# EasyEDA Pro project ProPrj_收音机.epro

# Schematic Schematic1

## Sheets
1 P1: Board Name: Board1; Create Date: 2025-11-10; Page Name: P1; Project Name: 收音机; Schematic Name: Schematic1; Update Date: 2025-11-12; Company: 嘉立创EDA; Page Size: A4; Version: V1.0
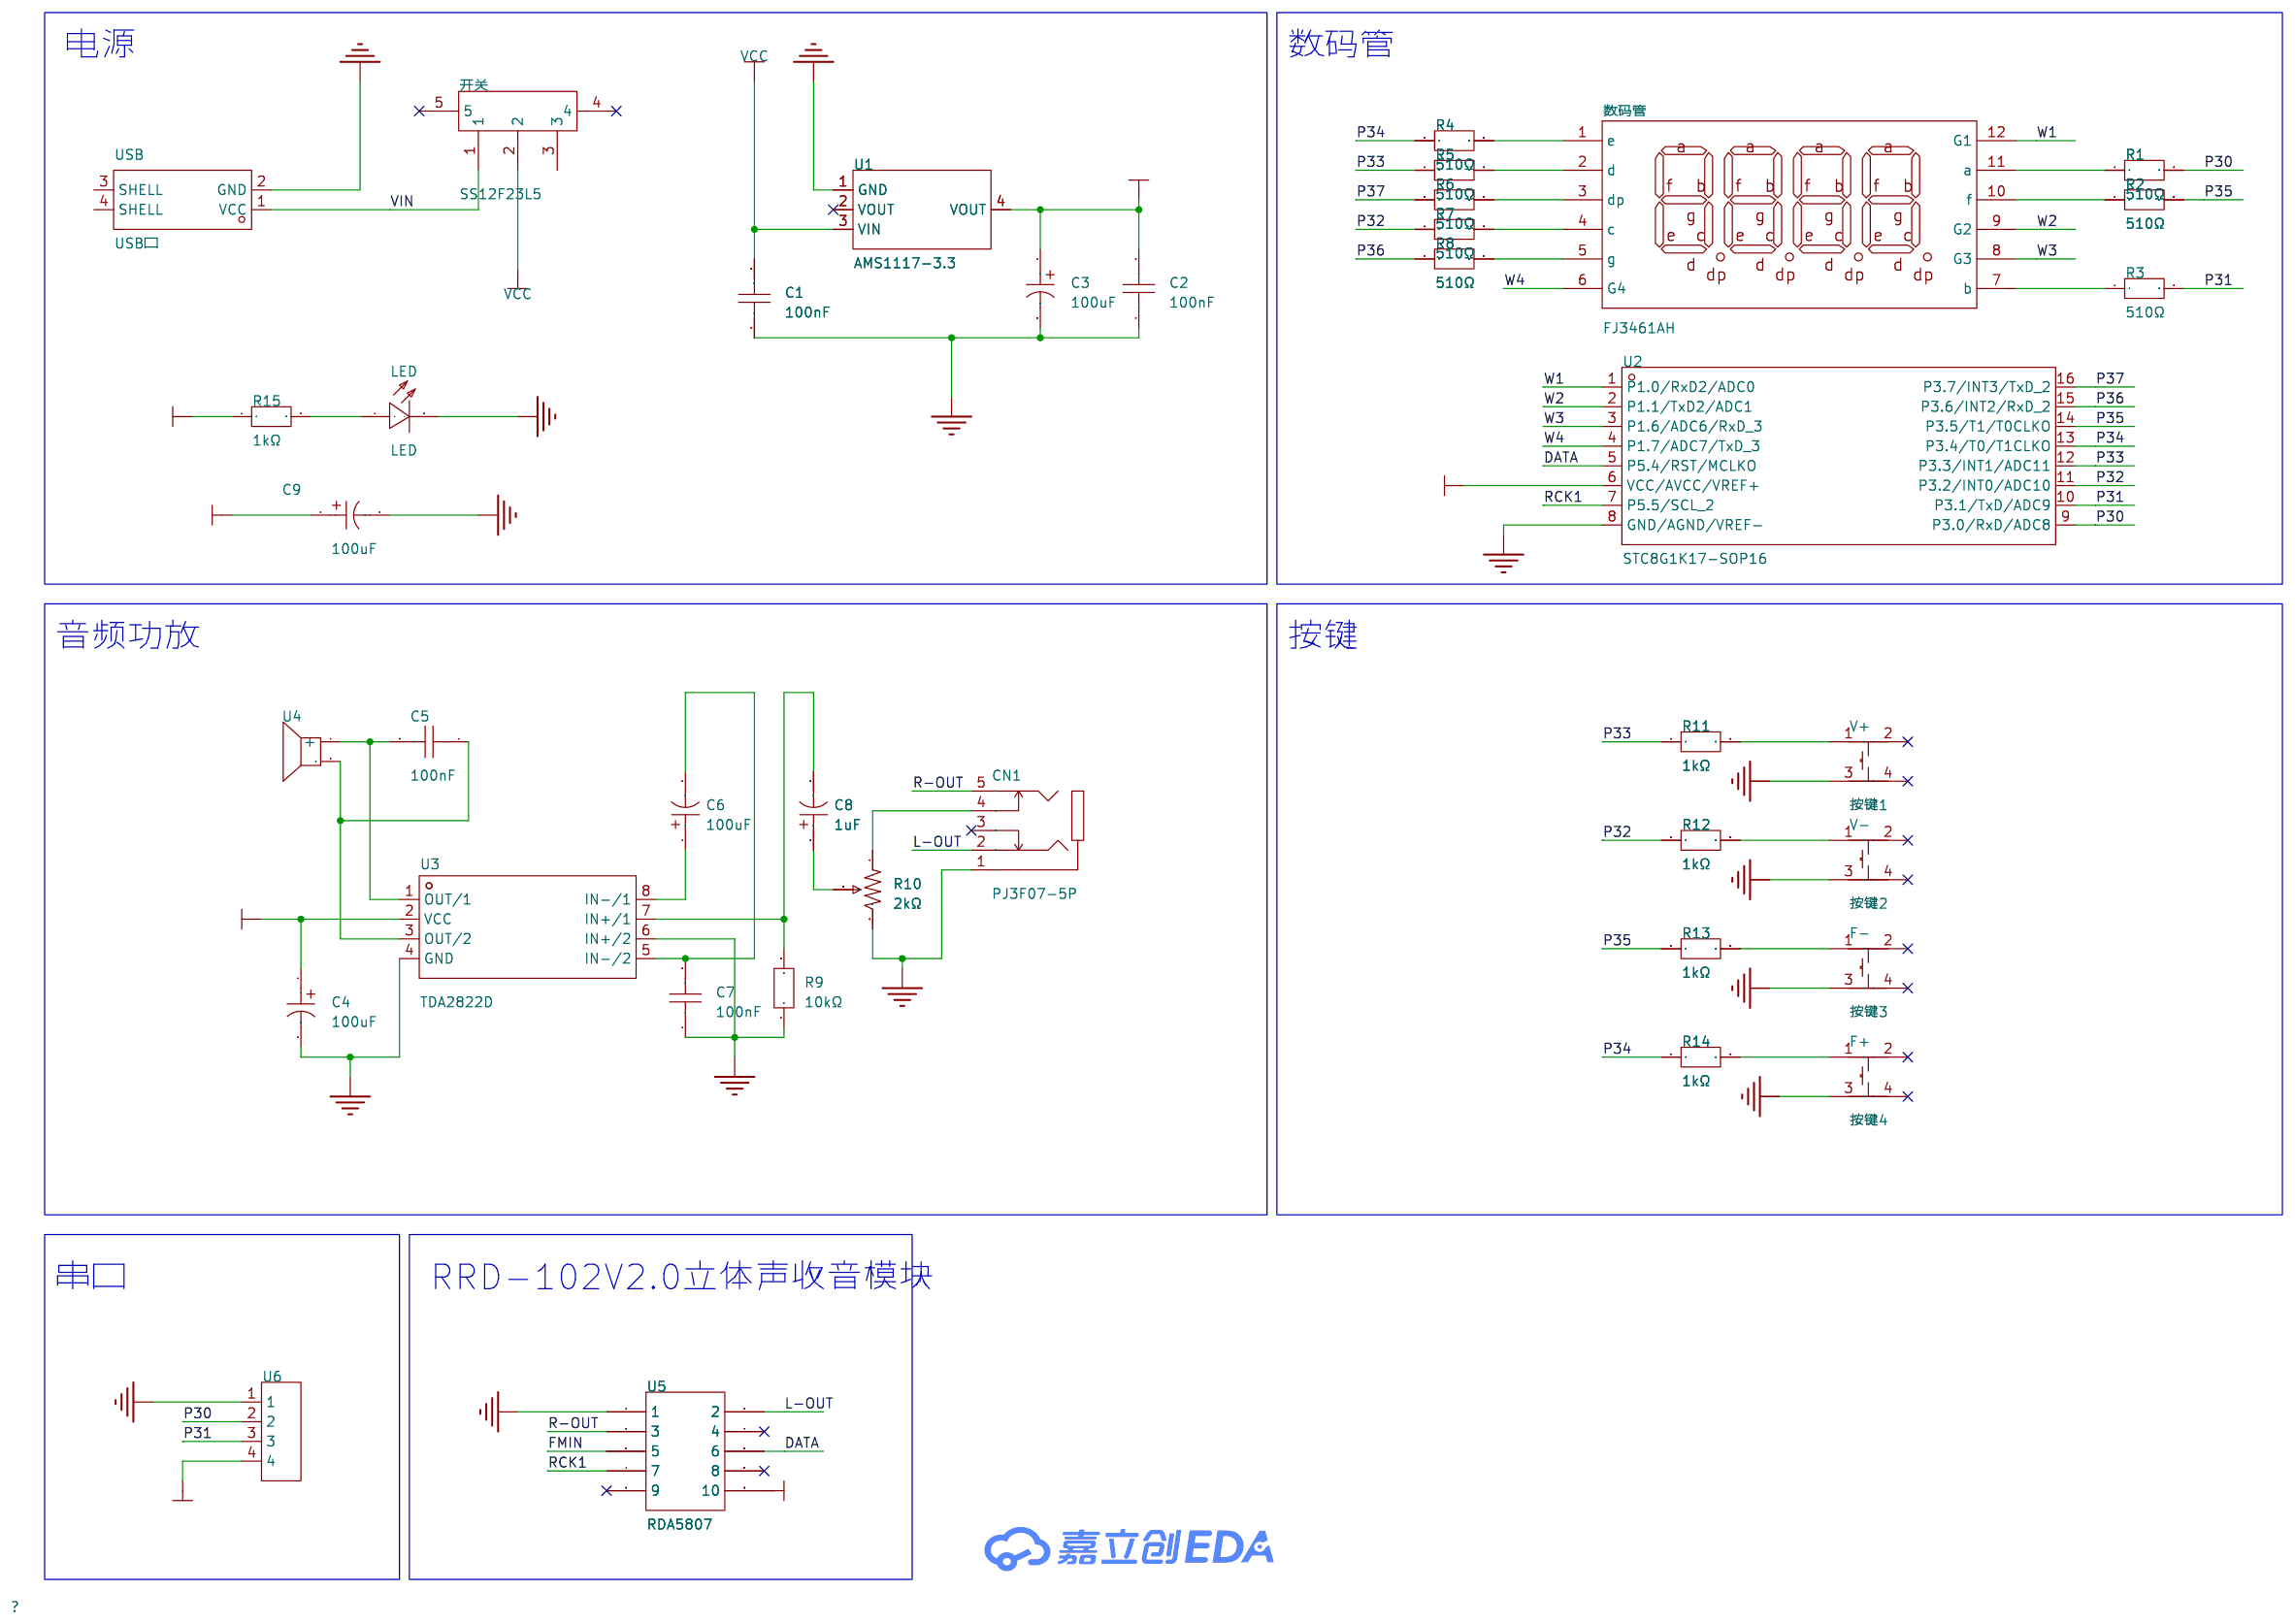
[diagram p0: P1]
2 P2: Create Date: 2025-11-11
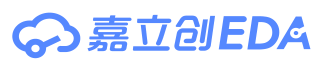
[diagram p1: P2]

## Parts
C1  100nF  [C0603]
C2  100nF  [C0603]
C3  100uF  [CAP-TH_BD8.0-P3.50-D0.6-FD_1]
C4  100uF  [CAP-TH_BD8.0-P3.50-D0.6-FD_1]
C5  100nF  [C0603]
C6  100uF  [CAP-TH_BD8.0-P3.50-D0.6-FD_1]
C7  100nF  [C0603]
C8  1uF  [CAP-SMD_BD4.0-L4.3-W4.3-LS5.0-FD]
C9  100uF  [CAP-TH_BD8.0-P3.50-D0.6-FD_1]
CN1  PJ3F07-5P  [AUDIO-TH_PJ3F07-5P]
F+  按键4  [KEY-SMD_4P-L6.0-W6.0-P4.50-LS8.6]
F-  按键3  [KEY-SMD_4P-L6.0-W6.0-P4.50-LS8.6]
LED  LED  [LED-TH_BD4.0-P2.54-FD_RED]
R1  510Ω  [R0805]
R2  510Ω  [R0805]
R3  510Ω  [R0805]
R4  510Ω  [R0805]
R5  510Ω  [R0805]
R6  510Ω  [R0805]
R7  510Ω  [R0805]
R8  510Ω  [R0805]
R9  10kΩ  [R0805]
R10  2kΩ  [RES-ADJ-TH_3362X]
R11  1kΩ  [R0603]
R12  1kΩ  [R0603]
R13  1kΩ  [R0603]
R14  1kΩ  [R0603]
R15  1kΩ  [R0805]
U1  AMS1117-3.3  [SOT-223-3_L6.5-W3.4-P2.30-LS7.0-BR]
U2  STC8G1K17-SOP16  [SOP-16_L9.9-W3.9-P1.27-LS6.0-BL]
U3  TDA2822D  [SOIC-8_L4.9-W3.9-P1.27-LS6.0-BL]
U4  2.048kHz  [BUZ-TH_BD16.0-P7.60-D0.7]
U5  Header-D-F 2x5P  [RDA5807]
U6  HX PZ2.54-1x4P ZZ  [HDR-TH_4P-P2.54-V-M]
USB  USB口  [MICRO-USB-TH_KH-MICRO-DIP-2P]
V+  按键1  [KEY-SMD_4P-L6.0-W6.0-P4.50-LS8.6]
V-  按键2  [KEY-SMD_4P-L6.0-W6.0-P4.50-LS8.6]
开关  SS12F23L5  [SW-TH_XKBCONNECTIVITY_SS12F23L5]
数码管  FJ3461AH  [LED-SEG-TH_12P-L30.0-W14.0-P2.54-S10.16-BL]

## Library data of the parts
C1 C2 C5 C7 = CC0603KRX7R9BB104: 容值:100nF;精度:±10%;额定电压:50V;温度系数:X7R;; LCSC Part Name: 100nF ±10% 50V; Supplier Part: C14663; Manufacturer: YAGEO(国巨); Supplier Footprint: 0603; JLCPCB Part Class: 基础库; Datasheet: https://item.szlcsc.com/datasheet/CC0603KRX7R9BB104/15331.html; Supplier: LCSC; Tolerance: ±10%; Voltage Rating: 50V; Temperature Coefficient: X7R
C3 C4 C6 C9 = 100uF: Supplier Part: C9900016884; Supplier Footprint: CAP-TH_BD8.0-P3.50-D1.0-FD; JLCPCB Part Class: 扩展库; Supplier: LCSC
C8 = RST50V1M4X5: 容值:1uF;精度:±20%;额定电压:50V;纹波电流:7mA@120Hz;; LCSC Part Name: 1uF ±20% 50V; Supplier Part: C48970983; Manufacturer: JIERR(捷而瑞); Supplier Footprint: SMD,D4xL5.4mm; JLCPCB Part Class: Extended Part; Datasheet: https://item.szlcsc.com/datasheet/RST50V1M4X5/51296188.html; Supplier: LCSC; Tolerance: ±20%; Voltage Rating: 50V; Ripple Current: 7mA@120Hz; Diameter: 4mm; Height - Seated (Max): 5.4mm; Lifetime: 2000hrs@105℃; Operating Temperature: -40℃~+105℃
CN1 = PJ3F07-5P: 连接器类型:3.5mm耳机座;额定电流:500mA;额定电压:30V;触头材质:铜;触头镀层:银;工作温度:-30℃~+70℃;; LCSC Part Name: 3.5mm耳机座 停产; Supplier Part: C668604; Manufacturer: SHOU HAN(首韩); Supplier Footprint: 插件; JLCPCB Part Class: 扩展库; Datasheet: https://item.szlcsc.com/datasheet/PJ3F07-5P/698547.html; Supplier: LCSC; Connector Type: 3.5mm耳机座; Current Rating: 500mA; Voltage Rating (Max): 30V; Contact Material: 铜; Contact Plating: 银; Operating Temperature: -30℃~+70℃
F+ F- V+ V- = ZX-QC66-7.5TP: 电路结构:单刀单掷;按钮形状:圆形按钮;作用力:2.6N;安装方式:立贴;开关长度:6mm;开关宽度:6mm;开关高度:7.5mm;带支架:不带支架;触点电流:50mA;额定电压:12V;工作寿命:10万次;; LCSC Part Name: 6*6*7.5贴片; Supplier Part: C7470157; Manufacturer: Megastar(兆星); Supplier Footprint: SMD-4P,6x6mm; JLCPCB Part Class: 扩展库; Datasheet: https://item.szlcsc.com/datasheet/ZX-QC66-7.5TP/8519163.html; Supplier: LCSC; Circuit: 单刀单掷; Actuator Style: 圆形按钮; Operating Force: 2.6N; Mounting Type: 立贴; Length: 6mm; Width: 6mm; Switch Height: 7.5mm; with Bracket: 不带支架; Contact Current: 50mA; Voltage Rating: 12V; Actuator/Cap Color: 黑色; Termination Style: 鸥翼型; Life: 10万次; Operating Temperature: -30℃~+80℃
LED = LED: Supplier Part: C9900015665; Supplier Footprint: SIP-2P; JLCPCB Part Class: 扩展库; Supplier: LCSC
R1-R8 = 0805W8F5100T5E: 电阻类型:厚膜电阻;阻值:510Ω;精度:±1%;功率:125mW;工作电压:150V;温度系数:±100ppm/℃;; LCSC Part Name: 510Ω ±1% 125mW 厚膜电阻; Supplier Part: C17734; Manufacturer: UNI-ROYAL(厚声); Supplier Footprint: 0805; JLCPCB Part Class: Basic Part; Datasheet: https://item.szlcsc.com/datasheet/0805W8F5100T5E/18422.html; Supplier: LCSC; Type: 厚膜电阻; Tolerance: ±1%; Power(Watts): 125mW; Voltage-Supply(Max): 150V; Temperature Coefficient: ±100ppm/℃; Operating Temperature: -55℃~+155℃
R9 = 0805W8F1002T5E_C17414: 电阻类型:厚膜电阻;阻值:10kΩ;精度:±1%;功率:125mW;工作电压:150V;温度系数:±100ppm/℃;; LCSC Part Name: 10kΩ ±1% 125mW 厚膜电阻; Supplier Part: C17414; Manufacturer: UNI-ROYAL(厚声); Manufacturer Part: 0805W8F1002T5E; Supplier Footprint: 0805; JLCPCB Part Class: Basic Part; Datasheet: https://item.szlcsc.com/datasheet/0805W8F1002T5E/18102.html; Supplier: LCSC; Type: 厚膜电阻; Tolerance: ±1%; Power(Watts): 125mW; Voltage-Supply(Max): 150V; Temperature Coefficient: ±100ppm/℃; Operating Temperature: -55℃~+155℃
R10 = 3362X-1-202: 阻值:2kΩ;精度:±10%;功率:500mW;温度系数:±250ppm/℃;; Supplier Part: C48997899; Manufacturer: JIERR(捷而瑞); Supplier Footprint: 插件-3P,7x6.8mm; JLCPCB Part Class: 扩展库; Datasheet: https://item.szlcsc.com/datasheet/3362X-1-202/51342035.html; Supplier: LCSC; Tolerance: ±10%; Power(Watts): 500mW; Temperature Coefficient: ±250ppm/℃; Number of Turns: 1
R11-R14 = SR0603JR-071KL: 电阻类型:厚膜电阻;阻值:1kΩ;精度:±5%;功率:100mW;工作电压:150V;温度系数:±100ppm/℃;; LCSC Part Name: 厚膜电阻 1kΩ ±5% 100mW; Supplier Part: C873708; Manufacturer: YAGEO(国巨); Supplier Footprint: 0603; JLCPCB Part Class: 扩展库; Datasheet: https://item.szlcsc.com/datasheet/SR0603JR-071KL/933820.html; Supplier: LCSC; Type: 厚膜电阻; Tolerance: ±5%; Power(Watts): 100mW; Voltage-Supply(Max): 150V; Temperature Coefficient: ±100ppm/℃; Operating Temperature: -55℃~+155℃
R15 = 0805W8F1001T5E: 电阻类型:厚膜电阻;阻值:1kΩ;精度:±1%;功率:125mW;最大工作电压:150V;温度系数:±100ppm/℃;; LCSC Part Name: 1kΩ ±1% 125mW 厚膜电阻; Supplier Part: C17513; Manufacturer: UNI-ROYAL(厚声); Supplier Footprint: 0805; JLCPCB Part Class: Basic Part; Datasheet: https://atta.szlcsc.com/upload/public/pdf/source/20200306/C422600_1E6D84923E4A46A82E41ADD87F860B5C.pdf; Supplier: LCSC; Type: 厚膜电阻; Tolerance: ±1%; Power(Watts): 125mW; Overload Voltage (Max): 150V; Temperature Coefficient: ±100ppm/℃; Operating Temperature Range: -55℃~+155℃
U1 = AMS1117-3.3_C6186: 输出类型:固定;工作电压:16V;输出电压:3.3V;输出电流:1A;电源纹波抑制比(PSRR):72dB@(120Hz);输出极性:正极;; LCSC Part Name: 输出3.3V 1A; Supplier Part: C6186; Manufacturer: AMS; Supplier Footprint: SOT-223; JLCPCB Part Class: 基础库; Datasheet: https://item.szlcsc.com/datasheet/AMS1117-3.3/6652.html; Supplier: LCSC; Output Type: 固定; Voltage - Supply: 16V; Output Voltage: 3.3V; Output Current: 1A; Power Supply Rejection Ratio (PSRR): 72dB@(120Hz); Voltage Dropout: 1.1V@(800mA); standby current: 5mA; Noise: 0.003%Vout; Features: 过流保护；过热保护; Operating Temperature: -40℃~+125℃; Output Configuration: 正极; Number of Outputs: 1
U2 = STC8G1K17-SOP16: Supplier Part: C2840656; Supplier Footprint: SOP-16; JLCPCB Part Class: 扩展库; Datasheet: https://atta.szlcsc.com/upload/public/pdf/source/20230914/7707908C45C6343AE73767C1466DDB8D.pdf; Supplier: LCSC
U3 = TDA2822D: 功放类型:AB类功放;扬声器通道数:单声道;输出功率:380mWx2@8Ω；1Wx1@32Ω;; LCSC Part Name: 停产 双路低压功率放大器; Supplier Part: C12045; Manufacturer: ST(意法半导体); Supplier Footprint: SO-8; JLCPCB Part Class: 扩展库; Datasheet: https://item.szlcsc.com/datasheet/TDA2822D/12600.html; Supplier: LCSC; Class: AB类功放; Speaker Channels: 单声道; Output Power: 380mWx2@8Ω；1Wx1@32Ω; Voltage - Supply: 1.8V~15V; Operating Temperature: -40℃~+150℃
U4 = AP-1612Z-P: 驱动方式:无源(外部驱动);构造类型:电磁式;额定电压:12V;频率:2.048kHz;声压(SPL):85dB;; LCSC Part Name: 扬声器; Supplier Part: C19272529; Manufacturer: Dragonstate(华龙); Supplier Footprint: 插件,D=7.6mm; JLCPCB Part Class: 扩展库; Datasheet: https://item.szlcsc.com/datasheet/AP-1612Z-P/20550668.html; Supplier: LCSC; Driver Circuitry: 无源(外部驱动); Technology: 电磁式; Voltage Rating: 12V; Voltage - Supply: 6V~15V; Current Consumption: 80mA; Sound Pressure Level(SPL): 85dB; Diameter(φD): 16mm; Height: 14mm; Operating Temperature: -40℃~+85℃
U5 = Header-D-F 2x5P: 2x5pin, 直插, 双排座; Revision: V1.0; Footprint Name: HDR2X5-F
U6 = HX PZ2.54-1x4P ZZ: 插针结构:1x4P;间距:2.54mm;行距:-;圆针/方针:方针;安装方式:直插;排数:单排;总PIN位数:4P;额定电流:3A;额定电压:1kV;配合针长度:6mm;塑高:2.5mm;端接针长度:3mm;触头材质:黄铜;触头镀层:金;工作温度:-40℃~+105℃;颜色:黑色;; LCSC Part Name: 1x4P 间距:2.54mm 方针 直插; Supplier Part: C32713270; Manufacturer: hanxia(韩下); Supplier Footprint: 插件,P=2.54mm; JLCPCB Part Class: 扩展库; Datasheet: https://item.szlcsc.com/datasheet/HX%2520PZ2.54-1x4P%2520ZZ/34444550.html; Supplier: LCSC; Pin Structure: 1x4P; Pitch: 2.54mm; Circluar Pins/Square Pins: 方针; Mounting Type: 直插; Number of Rows: 单排; Number of Pins: 4P; Current Rating: 3A; Voltage Rating (Max): 1kV; Length of Mating Pin: 6mm; Insulation Height: 2.5mm; Length of End Connection Pin: 3mm; Contact Material: 黄铜; Contact Plating: 金; Operating Temperature: -40℃~+105℃; Color: 黑色
USB = KH-MICRO-DIP-2P: 连接器类型:Micro-B;协议标准:USB 2.0;公母:母;安装方式:弯插;触点数量:5P;端口数量:1;额定电流 - 电源:1.5A;工作温度:-;; LCSC Part Name: Micro-B 母 弯插; Supplier Part: C2688800; Manufacturer: kinghelm(金航标); Supplier Footprint: 弯插; JLCPCB Part Class: 扩展库; Datasheet: https://item.szlcsc.com/datasheet/KH-MICRO-DIP-2P/2794731.html; Supplier: LCSC; Connector Type: Micro-B; Protocol Standard: USB 2.0; Gender: 母; Mounting Type: 弯插; Number of Contacts: 5P; Number of Ports: 1; Current Rating-Power: 1.5A
开关 = SS12F23L5: 电路结构:单刀双掷;安装方式:-;开关颜色:黑色;额定电流:300mA;额定电压:50V;工作寿命:1万次;; Supplier Part: C2884749; Manufacturer: XKB Connection(中国星坤); Supplier Footprint: 插件,12.9x5.7mm; JLCPCB Part Class: 扩展库; Datasheet: https://item.szlcsc.com/datasheet/SS12F23L5/3095241.html; Supplier: LCSC; Circuit: 单刀双掷; Actuator Style: 矩形柱状; Termination Style: PC引脚; Length: 12.9mm; Width: 5.7mm; Switch Height: 6.7mm; Actuator Color: 黑色; Current Rating: 300mA; Voltage Rating: 50V; Life: 1万次; Operating Temperature: -40℃~+85℃
数码管 = FJ3461AH: 数码管位数:4位;字符尺寸(英寸):0.36;耗散功率(Pd):-;发光颜色:红色;LED极性:共阴极;; LCSC Part Name: 4位0.36英寸红色数码管 共阴极; Supplier Part: C10708; Manufacturer: 志浩; Supplier Footprint: 插件; JLCPCB Part Class: 扩展库; Datasheet: https://item.szlcsc.com/datasheet/FJ3461AH/11252.html; Supplier: LCSC; Number of Characters: 4位; Digit/Alpha Size(inch): 0.36; Illumination Color: 红色; LED Polarity: 共阴极

## Nets
3.3V: C2.2 C3.1 C4.1 C9.1 R15.1 U1.4(VOUT) U2.6(VCC/AVCC/VREF+) U3.2(VCC) U5.10 U6.4
GND: C1.1 C2.1 C3.2 C4.2 C7.1 C9.2 CN1.1(A) F+.3 F-.3 LED.2(-) R9.1 R10.3 U1.1(GND) U2.8(GND/AGND/VREF-) U3.4(GND) U3.6(IN+/2) U5.1 U6.1 USB.2(GND) V+.3 V-.3
VCC: C1.2 U1.3(VIN) 开关.2
VIN: USB.1(VCC) 开关.1
DATA: U2.5(P5.4/RST/MCLKO) U5.6
FMIN: U5.5
L-OUT: CN1.2(B) U5.2
P30: R1.2 U2.9(P3.0/RxD/ADC8) U6.2
P31: R3.2 U2.10(P3.1/TxD/ADC9) U6.3
P32: R7.1 R12.1 U2.11(P3.2/INT0/ADC10)
P33: R5.1 R11.1 U2.12(P3.3/INT1/ADC11)
P34: R4.1 R14.1 U2.13(P3.4/T0/T1CLKO)
P35: R2.2 R13.1 U2.14(P3.5/T1/T0CLKO)
P36: R8.1 U2.15(P3.6/INT2/RxD_2)
P37: R6.1 U2.16(P3.7/INT3/TxD_2)
R-OUT: CN1.5(E) U5.3
RCK1: U2.7(P5.5/SCL_2) U5.7
W1: U2.1(P1.0/RxD2/ADC0) 数码管.12(G1)
W2: U2.2(P1.1/TxD2/ADC1) 数码管.9(G2)
W3: U2.3(P1.6/ADC6/RxD) 数码管.8(G3)
W4: U2.4(P1.7/ADC7/TxD_3) 数码管.6(G4)
$1N1935: R3.1 数码管.7(b)
$1N1940: R7.2 数码管.4(c)
$1N1945: R5.2 数码管.2(d)
$1N1950: R4.2 数码管.1(e)
$1N1955: R2.1 数码管.10(f)
$1N1960: R8.2 数码管.5(g)
$1N1965: R6.2 数码管.3(dp)
Net-(C5-1): C5.1 U3.3(OUT/2) U4.2
Net-(C5-2): C5.2 U3.1(OUT/1) U4.1(+)
Net-(C6-1): C6.1 U3.8(IN-/1)
Net-(C6-2): C6.2 C7.2 U3.5(IN-/2)
Net-(C8-1): C8.1 R10.2
Net-(C8-2): C8.2 R9.2 U3.7(IN+/1)
Net-(CN1-4): CN1.4(D) R10.1
Net-(F+-1): F+.1 R14.2
Net-(F--1): F-.1 R13.2
Net-(LED-1): LED.1(+) R15.2
Net-(R1-1): R1.1 数码管.11(a)
Net-(R11-2): R11.2 V+.1
Net-(R12-2): R12.2 V-.1

Not connected (* = marked no-connect by the designer): CN1 3(C)*; F+ 2* 4*; F- 2* 4*; U1 2(VOUT)*; U5 4* 8* 9*; USB 3(SHELL) 4(SHELL); V+ 2* 4*; V- 2* 4*; 开关 3 4* 5*

## Notes on the sheets
sheet 1
- 电源
- 数码管
- 音频功放
- 按键
- 串口
- RRD-102V2.0立体声收音模块

# Board PCB1
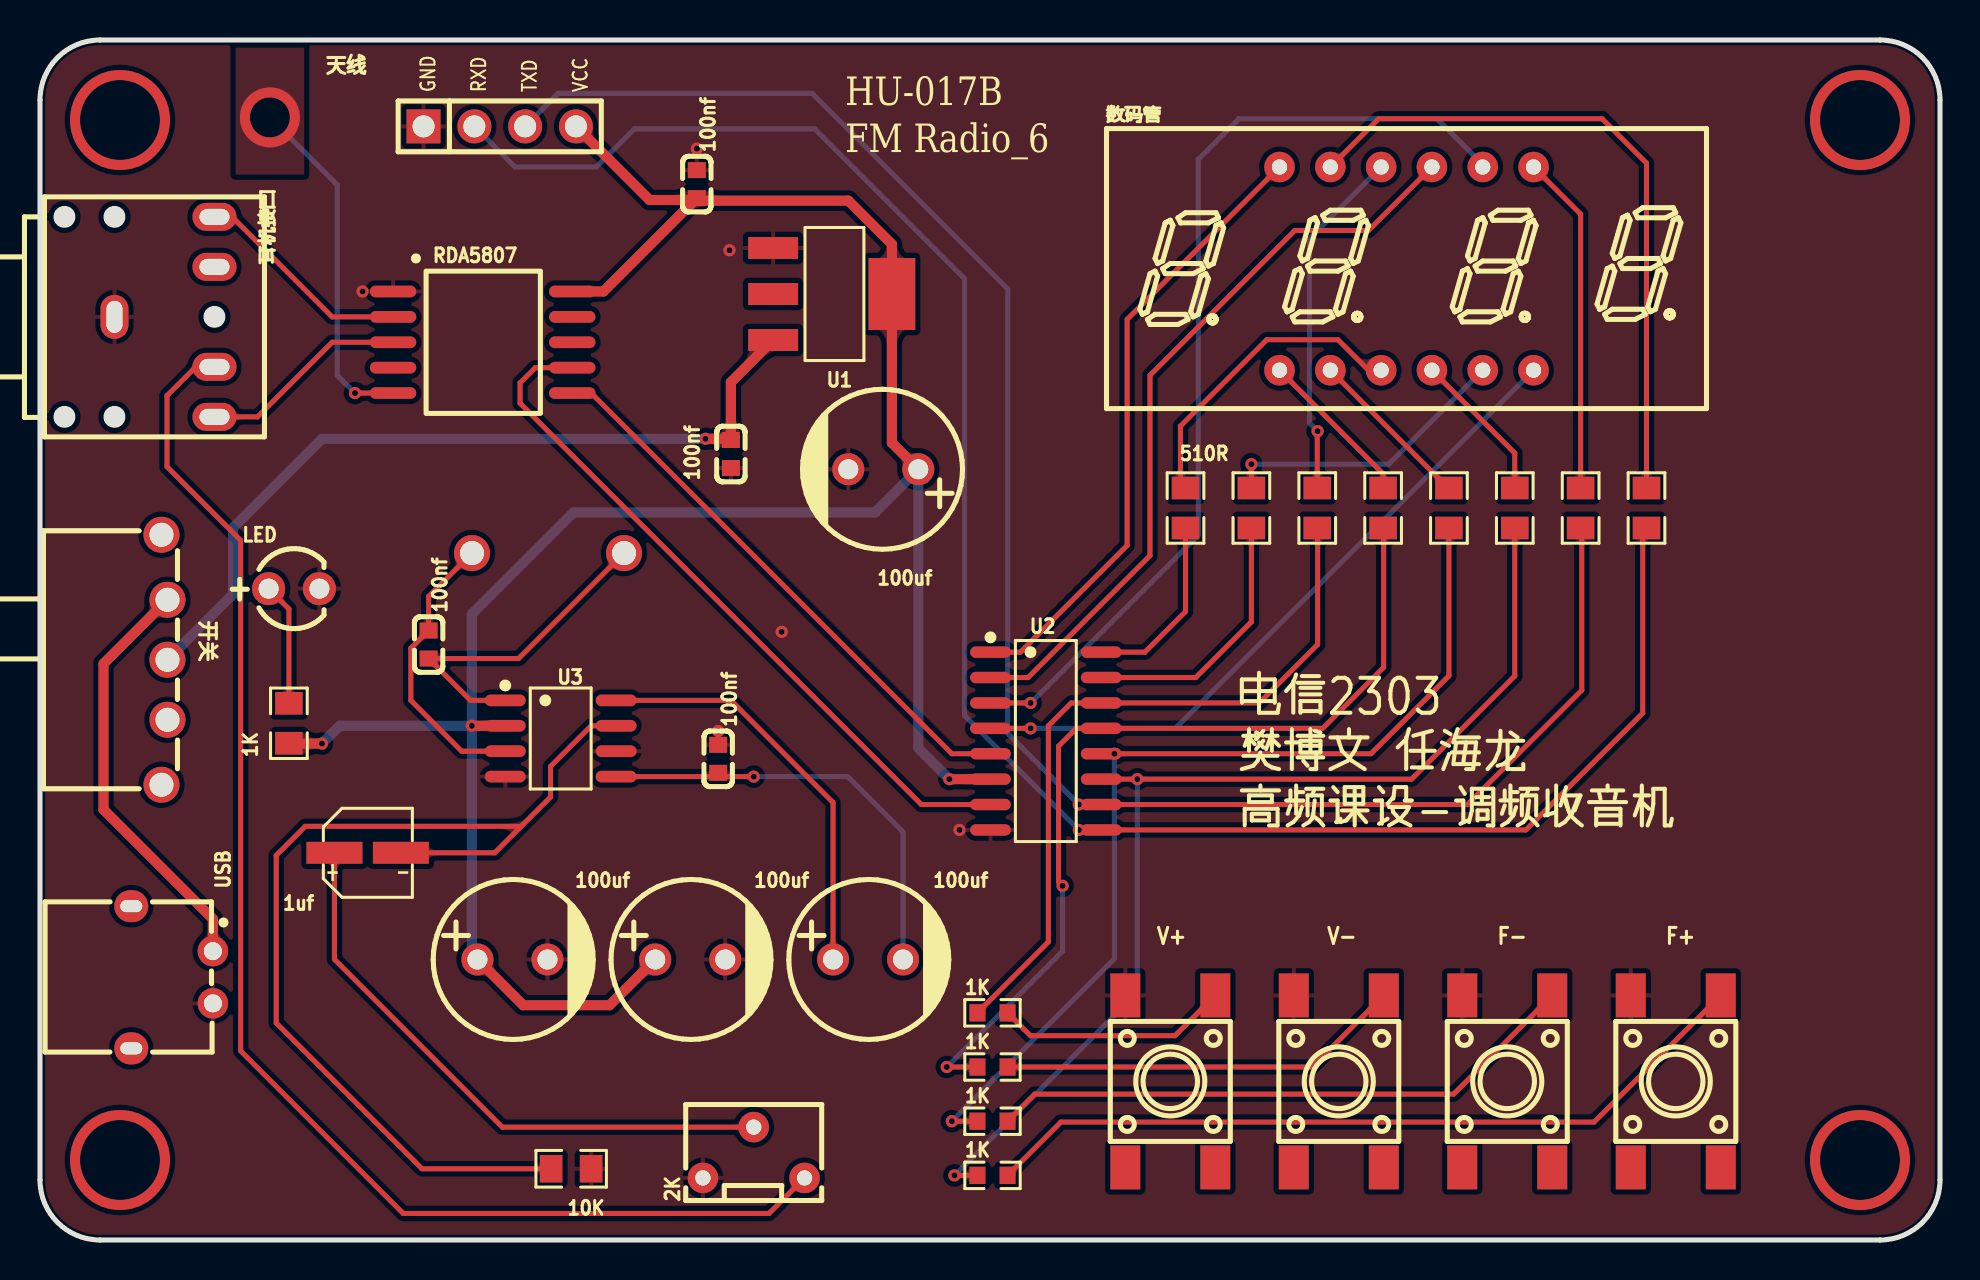
[diagram p2: board, top side]
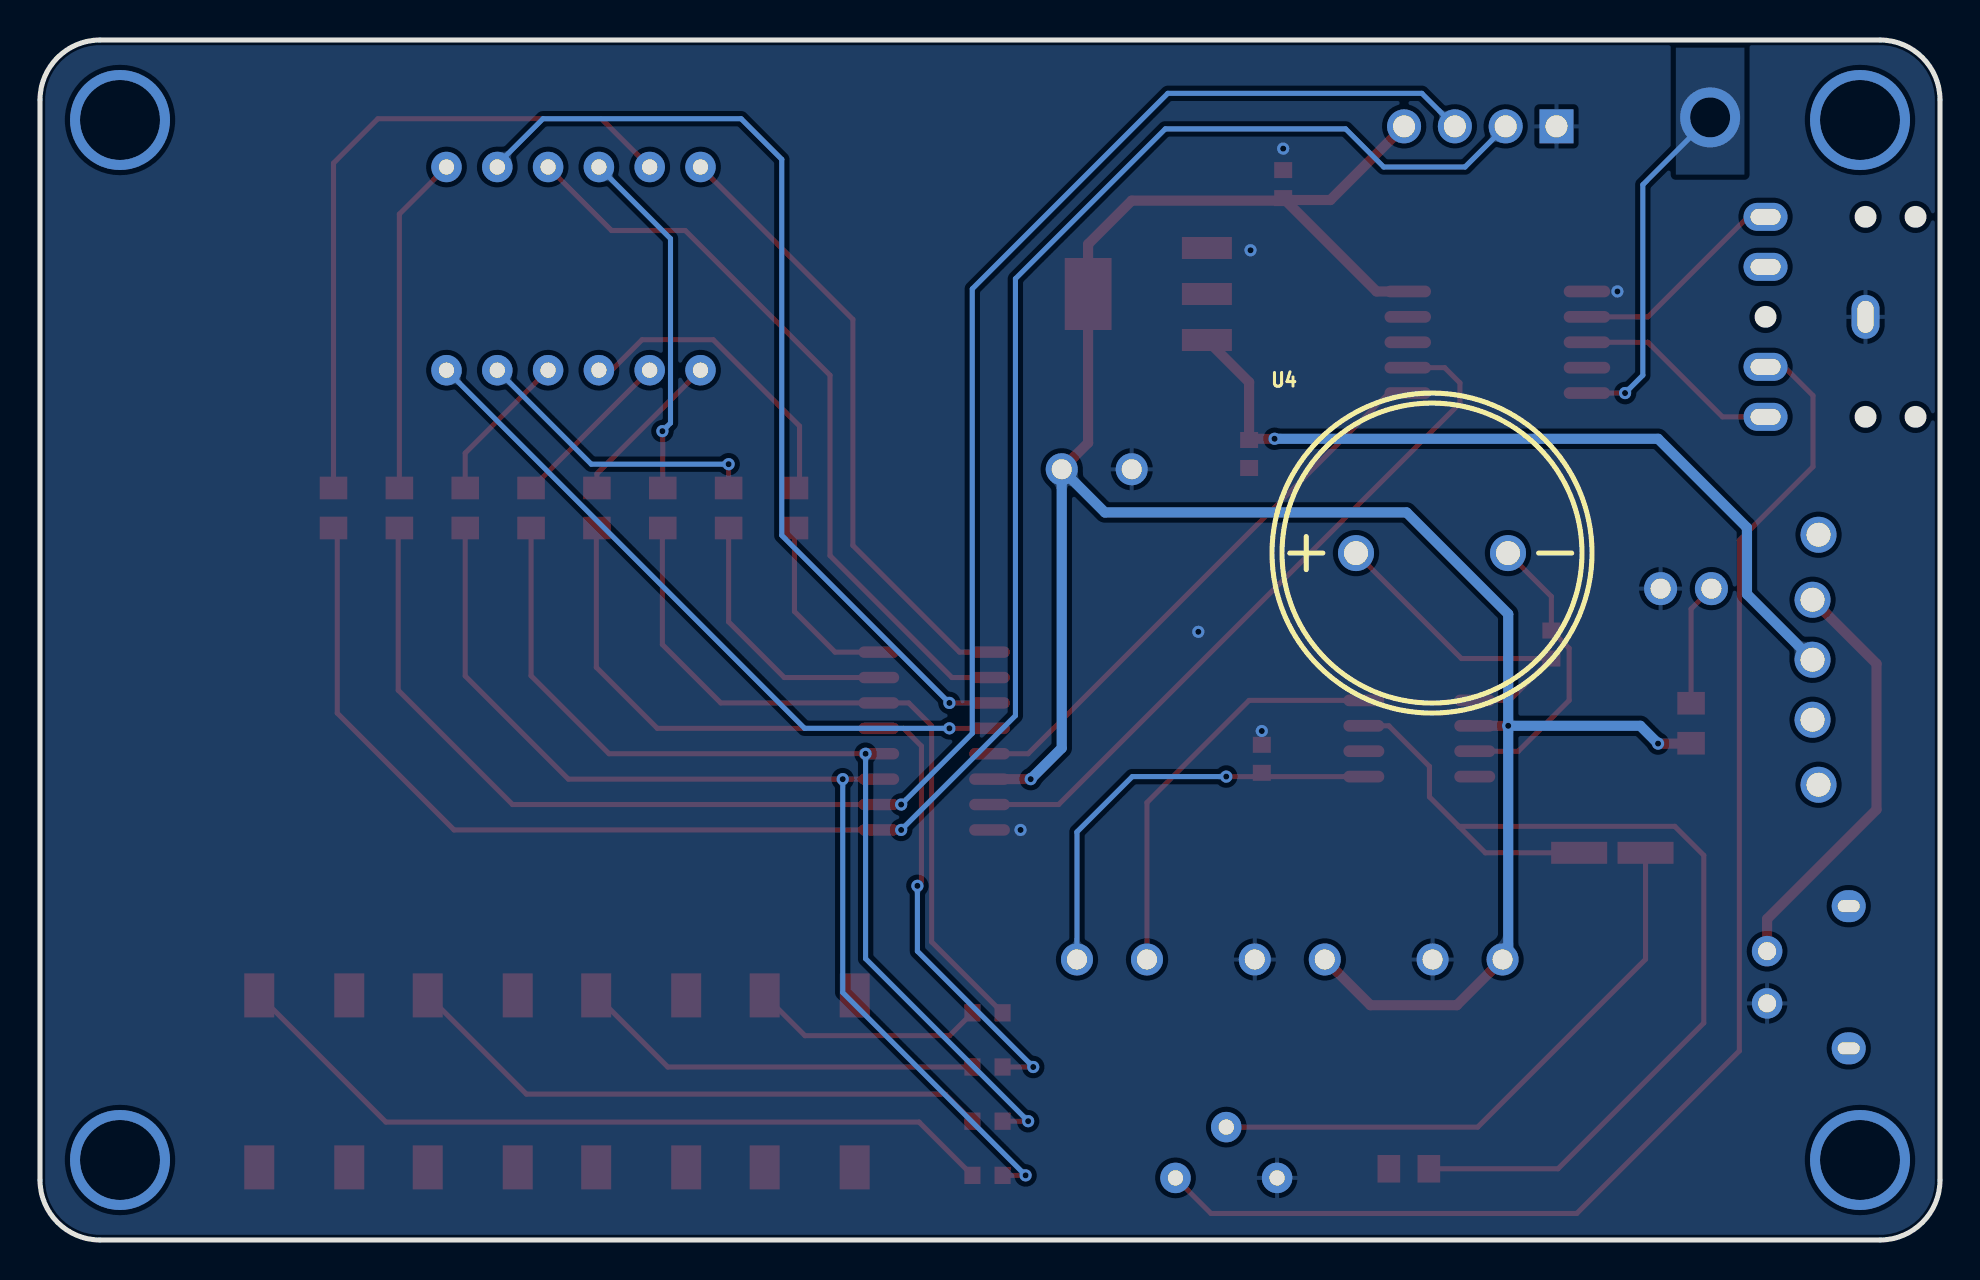
[diagram p3: board, bottom side, seen from below]

Outline 95 x 60 mm; copper layers: Top Layer, Bottom Layer. Coordinates in mm from the lower left corner of the outline.
Outline path: 0,57 0,3 arc(0.88,0.88) 3,0 92,0 arc(94.12,0.88) 95,3 95,57 arc(94.12,59.12) 92,60 3,60 arc(0.88,59.12) 0,57
Stack: Top Layer 0.035mm / Dielectric1 1.51mm FR4 er 4.5 / Bottom Layer 0.035mm

## Design rules (mm)
template: JLCPCB Capability(Two Layers Board)
spacing copperThickness1oz (default): track to track 0.102, other pairs 0.152 to 0.3
spacing copperThickness2oz: track to track 0.203, other pairs 0.152 to 0.3
track width copperThickness1oz (default): min 0.127, default 0.254, max 2.54
track width copperThickness2oz: min 0.203, default 0.254, max 2.54
differential pair differentialPair (default): width min 0.127, default 0.254, max 2.54; gap min 0.152, default 0.152
via viaSize (default): diameter min 0.5, default 0.61, max 10; hole min 0.3, default 0.305, max 6.3

## Placement (name value [footprint] x y rotation side)
1K  -  [R0805]  12.45 25.84 90 top
1K#2  -  [R0603]  47.62 5.94 0 top
1K#3  -  [R0603]  47.62 3.23 0 top
1K#4  -  [R0603]  47.62 11.36 0 top
1K#5  -  [R0603]  47.62 8.65 0 top
1uf  1uF  [CAP-SMD_BD4.0-L4.3-W4.3-LS5.0-FD]  16.38 19.36 0 top
2K  2kΩ  [RES-ADJ-TH_3362X]  35.69 4.37 90 top
10K  10kΩ  [R0805]  26.56 3.56 180 top
100nf  -  [C0603]  34.54 39.3 90 top
100nf#2  -  [C0603]  32.84 52.8 270 top
100nf#3  -  [C0603]  33.91 24.06 270 top
100nf#4  -  [C0603]  19.43 29.77 270 top
100uf  -  [CAP-TH_BD8.0-P3.50-D0.6-FD_1]  41.4 14.03 0 top
100uf#2  -  [CAP-TH_BD8.0-P3.50-D0.6-FD_1]  42.16 38.54 180 top
100uf#3  -  [CAP-TH_BD8.0-P3.50-D0.6-FD_1]  32.51 14.03 0 top
100uf#4  -  [CAP-TH_BD8.0-P3.50-D0.6-FD_1]  23.62 14.03 0 top
510R  510Ω  [R0805]  80.32 36.6 270 top
F+  按键4  [KEY-SMD_4P-L6.0-W6.0-P4.50-LS8.6]  64.94 7.93 270 top
F-  按键3  [KEY-SMD_4P-L6.0-W6.0-P4.50-LS8.6]  56.51 7.93 270 top
LED  LED  [LED-TH_BD4.0-P2.54-FD_RED]  12.7 32.57 0 top
R2  510Ω  [R0805]  63.86 36.6 270 top
R3  510Ω  [R0805]  77.03 36.6 270 top
R4  510Ω  [R0805]  67.15 36.6 90 top
R5  510Ω  [R0805]  70.45 36.6 90 top
R6  510Ω  [R0805]  57.28 36.6 90 top
R7  510Ω  [R0805]  73.74 36.6 90 top
R8  510Ω  [R0805]  60.57 36.6 90 top
RDA5807  Header-D-F 2x5P  [RDA5807]  19.56 47.43 0 top
SW1  SS12F23L5  [SW-TH_XKBCONNECTIVITY_SS12F23L5]  6.22 29.01 270 top
U1  AMS1117-3.3  [SOT-223-3_L6.5-W3.4-P2.30-LS7.0-BR]  39.62 47.3 180 top
U2  STC8G1K17-SOP16  [SOP-16_L9.9-W3.9-P1.27-LS6.0-BL]  50.29 24.95 270 top
U3  TDA2822D  [SOIC-8_L4.9-W3.9-P1.27-LS6.0-BL]  26.03 25.08 270 top
U4  2.048kHz  [BUZ-TH_BD16.0-P7.60-D0.7]  25.4 34.35 180 bottom
U6  HX PZ2.54-1x4P ZZ  [HDR-TH_4P-P2.54-V-M]  22.99 55.68 0 top
USB  USB口  [MICRO-USB-TH_KH-MICRO-DIP-2P]  6.6 13.14 270 top
V+  按键1  [KEY-SMD_4P-L6.0-W6.0-P4.50-LS8.6]  73.36 7.93 270 top
V-  按键2  [KEY-SMD_4P-L6.0-W6.0-P4.50-LS8.6]  81.79 7.93 270 top
数码管  FJ3461AH  [LED-SEG-TH_12P-L30.0-W14.0-P2.54-S10.16-BL]  68.33 48.57 0 top
耳机接口  PJ3F07-5P  [AUDIO-TH_PJ3F07-5P]  6.22 46.16 90 top

## Footprints (pads in the part's own frame, mm; a bottom-side part is the same pattern mirrored in y, then rotated)
AUDIO-TH_PJ3F07-5P
  oval 2.2x1.4 hole 1.6x0.8: 1(0,2.5)
  oval 1.4x2.2 hole 0.8x1.5: 2(5,-2.5) 3(2.5,-2.5) 4(-2.5,-2.5) 5(-5,-2.5)
BUZ-TH_BD16.0-P7.60-D0.7
  round 1.8 hole 1.2: 1(-3.8,0) 2(3.8,0)
C0603
  rect 0.8x0.9 smd: 1(-0.7,0) 2(0.7,0)
CAP-SMD_BD4.0-L4.3-W4.3-LS5.0-FD
  rect 2.8x1.1 smd: 1(-1.661,0) 2(1.661,0)
CAP-TH_BD8.0-P3.50-D0.6-FD_1
  round 1.6 hole 1: 1(-1.75,0) 2(1.75,0)
HDR-TH_4P-P2.54-V-M
  rect 1.7x1.7 hole 1.1: 1(-3.81,0)
  round 1.7 hole 1.1: 2(-1.27,0) 3(1.27,0) 4(3.81,0)
KEY-SMD_4P-L6.0-W6.0-P4.50-LS8.6
  rect 2.2x1.5 smd: 1(-4.3,2.25) 2(4.3,2.25) 3(-4.3,-2.25) 4(4.3,-2.25)
LED-SEG-TH_12P-L30.0-W14.0-P2.54-S10.16-BL
  round 1.524 hole 0.762: 1(-6.35,-5.08) 2(-3.81,-5.08) 3(-1.27,-5.08) 4(1.27,-5.08) 5(3.81,-5.08) 6(6.35,-5.08) 7(6.35,5.08) 8(3.81,5.08) 9(1.27,5.08) 10(-1.27,5.08) 11(-3.81,5.08) 12(-6.35,5.08)
LED-TH_BD4.0-P2.54-FD_RED
  round 1.651 hole 1: 1(-1.27,0) 2(1.27,0)
MICRO-USB-TH_KH-MICRO-DIP-2P
  round 1.524 hole 0.9: 1(-1.305,2.04) 2(1.305,2.04)
  oval 1.6x1.7 hole 0.6x1.1: 3(-3.555,-2.04) 4(3.555,-2.04)
R0603
  rect 0.806x0.864 smd: 1(-0.753,0) 2(0.753,0)
R0805
  rect 1.133x1.377 smd: 1(-1,0) 2(1,0)
RDA5807
  oval 2.324x0.589 smd: 1(-1.905,0) 2(-1.905,-1.27) 3(-1.905,-2.54) 4(-1.905,-3.81) 5(-1.905,-5.08) 6(7.054,-5.08) 7(7.054,-3.81) 8(7.054,-2.54) 9(7.054,-1.27) 10(7.054,0)
RES-ADJ-TH_3362X
  round 1.524 hole 0.762: 1(-1.27,-2.54) 2(1.27,0) 3(-1.27,2.54)
SOIC-8_L4.9-W3.9-P1.27-LS6.0-BL
  oval 0.588x2.045 smd: 1(-1.905,-2.772) 2(-0.635,-2.772) 3(0.635,-2.772) 4(1.905,-2.772) 5(1.905,2.772) 6(0.635,2.772) 7(-0.635,2.772) 8(-1.905,2.772)
SOP-16_L9.9-W3.9-P1.27-LS6.0-BL
  oval 0.574x2.038 smd: 1(-4.445,-2.769) 2(-3.175,-2.769) 3(-1.905,-2.769) 4(-0.635,-2.769) 5(0.635,-2.769) 6(1.905,-2.769) 7(3.175,-2.769) 8(4.445,-2.769) 9(4.445,2.769) 10(3.175,2.769) 11(1.905,2.769) 12(0.635,2.769) 13(-0.635,2.769) 14(-1.905,2.769) 15(-3.175,2.769) 16(-4.445,2.769)
SOT-223-3_L6.5-W3.4-P2.30-LS7.0-BR
  rect 2.5x1.1 smd: 1(2.97,-2.3) 2(2.97,0) 3(2.97,2.3)
  rect 2.34x3.6 smd: 4(-2.97,0)
SW-TH_XKBCONNECTIVITY_SS12F23L5
  round 1.8 hole 1.2: 1(-3,0.15) 2(0,0.15) 3(3,0.15) 4(6.25,-0.15) 5(-6.25,-0.15)

## Nets
3.3V: 1K.1 100nf#2.2 100uf#2.1 100uf#3.1 100uf#4.1 RDA5807.10 U1.4 U2.6 U3.2 U6.4
GND: 2K.3 10K.1 100nf.1 100nf#2.1 100nf#3.1 100uf#2.2 100uf#3.2 100uf#4.2 F+.3 F-.3 LED.2 RDA5807.1 U1.1 U2.8 U3.4 U3.6 U6.1 USB.2 V+.3 V-.3 耳机接口.1
VCC: 100nf.2 SW1.2 U1.3
VIN: SW1.1 USB.1
DATA: RDA5807.6 U2.5
FMIN: RDA5807.5
L-OUT: RDA5807.2 耳机接口.2
P30: 510R.2 U2.9 U6.2
P31: R3.2 U2.10 U6.3
P32: 1K#3.1 R7.1 U2.11
P33: 1K#2.1 R5.1 U2.12
P34: 1K#5.1 R4.1 U2.13
P35: 1K#4.1 R2.2 U2.14
P36: R8.1 U2.15
P37: R6.1 U2.16
R-OUT: RDA5807.3 耳机接口.5
RCK1: RDA5807.7 U2.7
W1: U2.1 数码管.12
W2: U2.2 数码管.9
W3: U2.3 数码管.8
W4: U2.4 数码管.6
$1N1177: 100nf#4.1 U3.3 U4.2
$1N1182: 100nf#4.2 U3.1 U4.1
$1N1931: 510R.1 数码管.11
$1N1935: R3.1 数码管.7
$1N1940: R7.2 数码管.4
$1N1945: R5.2 数码管.2
$1N1950: R4.2 数码管.1
$1N1955: R2.1 数码管.10
$1N1960: R8.2 数码管.5
$1N1965: R6.2 数码管.3
$1N2049: 100uf.1 U3.8
$1N2054: 100nf#3.2 100uf.2 U3.5
$1N2190: 1uf.2 10K.2 U3.7
$1N2379: 1uf.1 2K.2
$1N2491: 2K.1 耳机接口.4
$1N3065: 1K#5.2 F+.1
$1N3069: 1K#4.2 F-.1
$1N3074: 1K#3.2 V-.1
$1N3079: 1K#2.2 V+.1
$1N3202: 1K.2 LED.1

Pads without a net: F+ 2 4; F- 2 4; RDA5807 4 8 9; SW1 3 4 5; U1 2; USB 3 4; V+ 2 4; V- 2 4; 耳机接口 3

## Via types
v1: diameter 5, hole 4, Top Layer to Bottom Layer, 4 vias
v2: diameter 0.61, hole 0.305, Top Layer to Bottom Layer, 24 vias
v3: diameter 3, hole 2, Top Layer to Bottom Layer, 1 via

## Routing (per net, layer and track width the routed paths; a pad name or vN(x,y) marks a point on that pad's centre or on a via; arc(x,y) is an arc through that point)
3.3V: length 121
  Top Layer w0.508: 1K.1 12.46,24.82 v2(14.1,24.82) ; 100uf#3.1 28.48,11.74 24.16,11.74 100uf#4.1 ; 32.74,52 28.17,47.43 RDA5807.10 ; 32.74,52 100nf#2.2 ; 32.74,52 30.48,52 U6.4 ; 32.84,51.97 40.42,51.97 42.59,49.79 U1.4 42.59,39.86 100uf#2.1 ; 47.52,23.04 v2(45.47,23.04) ; U3.2 v2(21.59,25.71)
  Bottom Layer w0.508: v2(21.59,25.71) 21.59,14.31 100uf#4.1 ; v2(21.59,25.71) 21.59,31.3 26.67,36.38 41.75,36.38 100uf#2.1 43.91,24.59 v2(45.47,23.04) ; v2(21.59,25.71) 14.99,25.71 v2(14.1,24.82)
GND:
  vias: v2(16.13,47.43) v2(32.84,54.57) v2(33.91,25.45) v2(34.47,49.49) v2(37.08,30.41) v2(45.97,20.5)
VCC: length 40.6
  Top Layer w0.508: U1.3 34.54,42.89 100nf.2 34.48,40.06 v2(33.27,40.06)
  Bottom Layer w0.508: v2(33.27,40.06) 14.1,40.06 9.65,35.62 9.65,32.29 SW1.2
VIN: length 21.2
  Top Layer w0.508: USB.1 8.64,16.05 3.17,21.52 3.17,28.81 SW1.1
(no net):
  vias: v1(4,56) v1(4,4) v1(91,56) v1(91,4)
DATA: length 28.4
  Top Layer w0.254: RDA5807.6 27.56,42.35 45.59,24.31 U2.5
FMIN: length 17.4
  Top Layer w0.254: RDA5807.5 v2(15.75,42.35)
  Bottom Layer w0.254: v2(15.75,42.35) 14.86,43.24 14.86,52.76 v3(11.49,56.13)
L-OUT: length 11
  Top Layer w0.254: 17.65,46.16 14.61,46.16 9.61,51.16 耳机接口.2
P30: length 99.1
  Top Layer w0.254: v2(51.94,20.5) 74.29,20.5 80.14,26.34 80.14,35.41 510R.2
  Bottom Layer w0.254: v2(51.94,20.5) 46.23,26.22 46.23,48.06 38.74,55.56 29.72,55.56 27.81,53.65 23.75,53.65 U6.2
P31: length 91.8
  Top Layer w0.254: v2(51.94,21.77) U2.10 71.37,21.77 77.09,27.49 77.09,35.54 R3.2
  Bottom Layer w0.254: U6.3 25.91,57.33 38.61,57.33 48.39,47.55 48.39,25.33 v2(51.94,21.77)
P32: length 55
  Top Layer w0.254: 53.06,23.04 v2(54.86,23.04) 68.58,23.04 73.74,28.2 R7.1 ; 1K#3.1 v2(45.72,3.23)
  Bottom Layer w0.254: v2(45.72,3.23) 54.86,12.38 v2(54.86,23.04)
P33: length 49.4
  Top Layer w0.254: 1K#2.1 v2(45.59,5.94) ; R5.1 70.45,28.21 66.55,24.31 v2(53.72,24.31) U2.12
  Bottom Layer w0.254: v2(53.72,24.31) 53.72,14.07 v2(45.59,5.94)
P34: length 44.9
  Top Layer w0.254: v2(51.13,17.71) 50.93,17.91 50.93,24.69 51.82,25.58 U2.13 64.13,25.58 67.18,28.63 67.18,35.57 R4.1 ; 1K#5.1 v2(45.34,8.65)
  Bottom Layer w0.254: v2(51.13,17.71) 51.13,14.44 v2(45.34,8.65)
P35: length 36.8
  Top Layer w0.254: R2.2 63.88,35.58 63.88,29.77 60.96,26.85 U2.14 51.56,26.85 50.42,25.71 50.42,14.91 1K#4.1
P36: length 13.4
  Top Layer w0.254: R8.1 60.57,30.91 57.78,28.12 53.06,28.12
P37: length 9.2
  Top Layer w0.254: R6.1 57.28,31.42 55.25,29.39 U2.16
R-OUT: length 10.5
  Top Layer w0.254: RDA5807.3 14.61,44.89 10.88,41.16 耳机接口.5
RCK1: length 35.8
  Top Layer w0.254: RDA5807.7 24.77,43.62 24,42.86 24,41.84 44.07,21.77 U2.7
W1: length 31.1
  Top Layer w0.254: U2.1 49.02,29.39 54.36,34.73 54.36,46.03 数码管.12
W2: length 37.9
  Top Layer w0.254: 数码管.9 66.42,50.47 62.74,50.47 55.5,43.24 55.5,34.22 49.4,28.12 47.52,28.12
W3: length 48.8
  Top Layer w0.254: U2.3 v2(49.53,26.85)
  Bottom Layer w0.254: 数码管.8 72.14,53.78 69.85,56.06 59.94,56.06 57.91,54.03 57.91,35.23 v2(49.53,26.85)
W4: length 34.6
  Top Layer w0.254: v2(49.53,25.58) U2.4
  Bottom Layer w0.254: 数码管.6 56.77,25.58 v2(49.53,25.58)
$1N1177: length 14.4
  Top Layer w0.254: U4.2 19.43,32.18 100nf#4.1 18.54,29.58 18.54,26.98 21.08,24.44 U3.3
$1N1182: length 16.7
  Top Layer w0.254: U4.1 23.93,29.07 100nf#4.2 21.53,26.98 U3.1
$1N1931: length 34
  Top Layer w0.254: 数码管.11 66.93,56.06 78.1,56.06 80.32,53.84 510R.1
$1N1935: length 17
  Top Layer w0.254: 数码管.7 77.03,51.29 R3.1
$1N1940: length 7.6
  Top Layer w0.254: 数码管.4 73.74,39.35 R7.2
$1N1945: length 8.4
  Top Layer w0.254: R5.2 70.41,37.6 数码管.2
$1N1950: length 8
  Top Layer w0.254: R4.2 67.15,38.31 数码管.1
$1N1955: length 17.7
  Top Layer w0.254: v2(63.88,40.44) 63.86,40.42 R2.1
  Bottom Layer w0.254: 数码管.10 63.47,50.07 63.47,40.85 v2(63.88,40.44)
$1N1960: length 14.7
  Top Layer w0.254: R8.2 v2(60.57,38.79)
  Bottom Layer w0.254: 数码管.5 67.44,38.79 v2(60.57,38.79)
$1N1965: length 15.7
  Top Layer w0.254: R6.2 57.02,37.85 57.02,40.7 61.34,45.01 64.9,45.01 66.42,43.49 数码管.3
$1N2049: length 20.8
  Top Layer w0.254: U3.8 34.54,26.98 39.65,21.87 100uf.1
$1N2054: length 22
  Top Layer w0.254: v2(35.69,23.17) 34.1,23.17 100nf#3.2 33.72,23.17 U3.5
  Bottom Layer w0.254: v2(35.69,23.17) 40.39,23.17 43.15,20.4 100uf.2
$1N2190: length 52.3
  Top Layer w0.254: U3.7 27.56,25.71 25.53,23.68 25.53,22.15 24.06,20.68 ; 1uf.2 22.73,19.36 24.06,20.68 ; 24.06,20.68 13.26,20.68 11.81,19.23 11.81,10.85 19.1,3.56 10K.2
$1N2379: length 29.8
  Top Layer w0.254: 2K.2 23.11,5.64 14.72,14.04 1uf.1
$1N2491: length 69.6
  Top Layer w0.254: 2K.1 36.45,1.33 18.16,1.33 10.03,9.45 10.03,34.98 6.35,38.66 6.35,42.22 7.79,43.66 耳机接口.4
$1N3065: length 20.3
  Top Layer w0.254: F+.1 63.61,8.65 1K#5.2
$1N3069: length 11.7
  Top Layer w0.254: F-.1 56.75,10.22 49.52,10.22 1K#4.2
$1N3074: length 39.4
  Top Layer w0.254: 1K#3.2 51.05,5.9 77.71,5.9 V-.1
$1N3079: length 29.8
  Top Layer w0.254: V+.1 70.68,7.29 49.73,7.29 1K#2.2
$1N3202: length 6.2
  Top Layer w0.254: LED.1 12.45,31.55 1K.2

## Copper pours and planes (outline as drawn; the poured copper is in the pictures)
GND on Top Layer: -10.03,66.35 112.65,66.35 112.65,-13.15 -10.03,-13.15
GND on Bottom Layer: -5.08,67.87 103,67.87 103,-10.36 -5.08,-10.36
FMIN on Top Layer: 9.78,59.62 13.21,59.62 13.21,53.27 9.78,53.27
FMIN on Bottom Layer: 9.78,59.62 13.21,59.62 13.21,53.27 9.78,53.27

Small or netless copper shapes (teardrops, artwork), in the pictures only: 120 on Top Layer, 32 on Bottom Layer

## Text on the board
Top Silkscreen Layer: GND | RXD | TXD | VCC | V+ | V- | F- | F+ | 开关 | 天线 | HU-017B / FM Radio_6 | 电信2303 / 樊博文 任海龙 / 高频课设-调频收音机
